# EAGLE design Board1a (EAGLE 7.4.0)
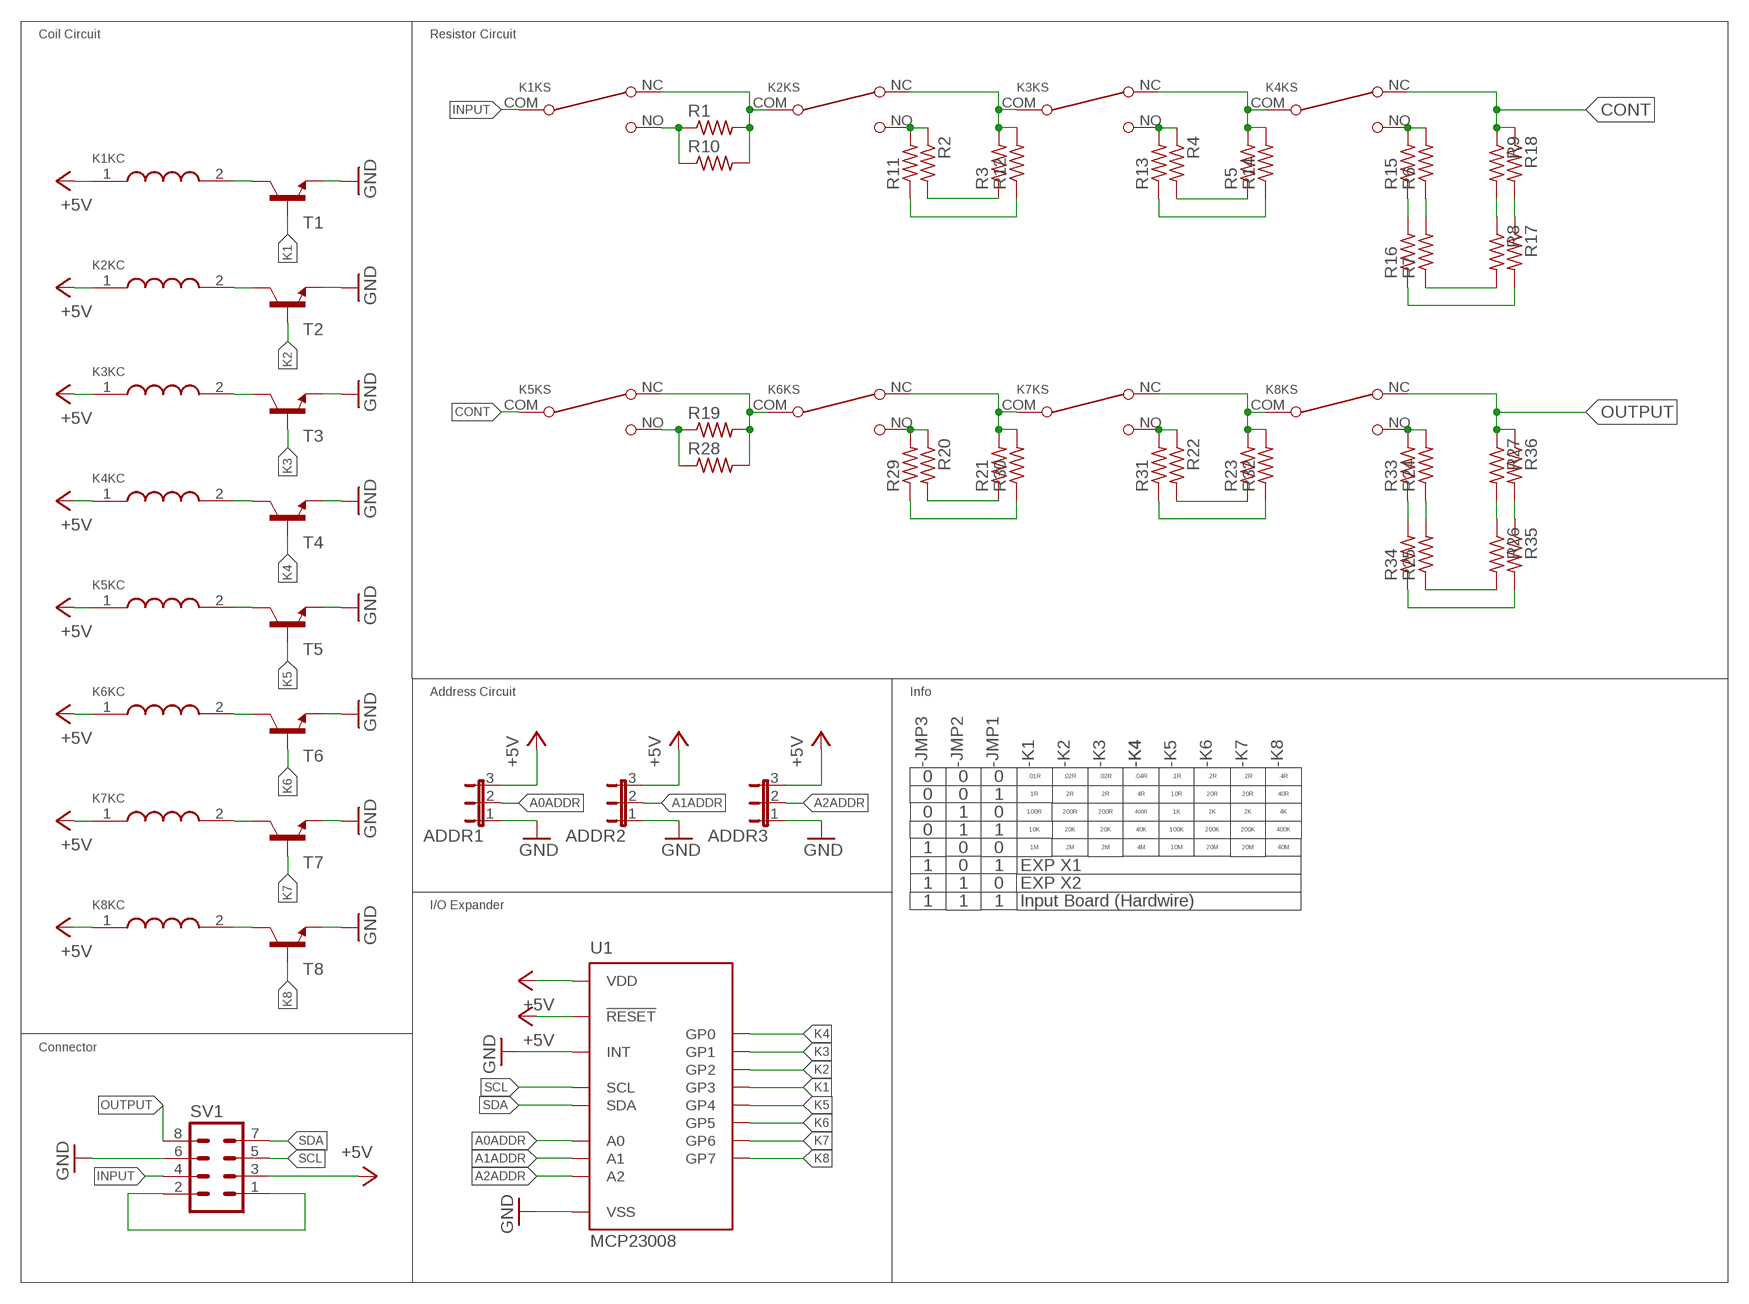
[diagram p0: schematic, sheet 1]

## Parts
ADDR1  JP2E  [JP2]
ADDR2  JP2E  [JP2]
ADDR3  JP2E  [JP2]
K1  G5LE-1-VD DC12  G5LE  [G5LE]
K2  G5LE  [G5LE]
K3  G5LE  [G5LE]
K4  G5LE  [G5LE]
K5  G5LE-1-VD DC12  G5LE  [G5LE]
K6  G5LE  [G5LE]
K7  G5LE  [G5LE]
K8  G5LE  [G5LE]
R1  R-US_0613/5V  [P0613V]
R2  R-US_0613/5V  [P0613V]
R3  R-US_0613/5V  [P0613V]
R4  R-US_0613/5V  [P0613V]
R5  R-US_0613/5V  [P0613V]
R6  R-US_0613/5V  [P0613V]
R7  R-US_0613/5V  [P0613V]
R8  R-US_0613/5V  [P0613V]
R9  R-US_0613/5V  [P0613V]
R10  R-US_M1206  [M1206]
R11  R-US_M1206  [M1206]
R12  R-US_M1206  [M1206]
R13  R-US_M1206  [M1206]
R14  R-US_M1206  [M1206]
R15  R-US_M1206  [M1206]
R16  R-US_M1206  [M1206]
R17  R-US_M1206  [M1206]
R18  R-US_M1206  [M1206]
R19  R-US_0613/5V  [P0613V]
R20  R-US_0613/5V  [P0613V]
R21  R-US_0613/5V  [P0613V]
R22  R-US_0613/5V  [P0613V]
R23  R-US_0613/5V  [P0613V]
R24  R-US_0613/5V  [P0613V]
R25  R-US_0613/5V  [P0613V]
R26  R-US_0613/5V  [P0613V]
R27  R-US_0613/5V  [P0613V]
R28  R-US_M1206  [M1206]
R29  R-US_M1206  [M1206]
R30  R-US_M1206  [M1206]
R31  R-US_M1206  [M1206]
R32  R-US_M1206  [M1206]
R33  R-US_M1206  [M1206]
R34  R-US_M1206  [M1206]
R35  R-US_M1206  [M1206]
R36  R-US_M1206  [M1206]
SV1  MA04-2  [MA04-2]
T1  MMUN2211LT1-NPN-SC59-BEC  [SC59-BEC]
T2  MMUN2211LT1-NPN-SC59-BEC  [SC59-BEC]
T3  MMUN2211LT1-NPN-SC59-BEC  [SC59-BEC]
T4  MMUN2211LT1-NPN-SC59-BEC  [SC59-BEC]
T5  MMUN2211LT1-NPN-SC59-BEC  [SC59-BEC]
T6  MMUN2211LT1-NPN-SC59-BEC  [SC59-BEC]
T7  MMUN2211LT1-NPN-SC59-BEC  [SC59-BEC]
T8  MMUN2211LT1-NPN-SC59-BEC  [SC59-BEC]
U1  MCP23008  [SOIC]

## Nets
+5V: ADDR1.3 ADDR2.3 ADDR3.3 K1.1(KC:COILA) K2.1(KC:COILA) K3.1(KC:COILA) K4.1(KC:COILA) K5.1(KC:COILA) K6.1(KC:COILA) K7.1(KC:COILA) K8.1(KC:COILA) SV1.3 U1.P$6(!RESET) U1.P$18(VDD)
A0ADDR: ADDR1.2 U1.P$5(A0)
A1ADDR: ADDR2.2 U1.P$4(A1)
A2ADDR: ADDR3.2 U1.P$3(A2)
CONT: K4.NC(KS:P$NC) K5.COM(KS:P$COM) R9.1 R18.1
GND: ADDR1.1 ADDR2.1 ADDR3.1 SV1.6 T1.E T2.E T3.E T4.E T5.E T6.E T7.E T8.E U1.P$8(INT) U1.P$9(VSS)
INPUT: K1.COM(KS:P$COM) SV1.4
K1: T1.B U1.P$13(GP3)
K2: T2.B U1.P$12(GP2)
K3: T3.B U1.P$11(GP1)
K4: T4.B U1.P$10(GP0)
K5: T5.B U1.P$14(GP4)
K6: T6.B U1.P$15(GP5)
K7: T7.B U1.P$16(GP6)
K8: T8.B U1.P$17(GP7)
N$1: K1.NO(KS:P$NO) R1.1 R10.1
N$2: K1.NC(KS:P$NC) K2.COM(KS:P$COM) R1.2 R10.2
N$3: R2.2 R3.1
N$4: K2.NC(KS:P$NC) K3.COM(KS:P$COM) R3.2 R12.2
N$5: SV1.1 SV1.2
N$6: K2.NO(KS:P$NO) R2.1 R11.2
N$7: K3.NC(KS:P$NC) K4.COM(KS:P$COM) R5.2 R14.2
N$8: K3.NO(KS:P$NO) R4.1 R13.2
N$9: K4.NO(KS:P$NO) R6.2 R15.2
N$10: R4.2 R5.1
N$11: K3.2(KC:COILB) T3.C
N$12: R6.1 R7.2
N$13: K1.2(KC:COILB) T1.C
N$14: R7.1 R8.2
N$15: K2.2(KC:COILB) T2.C
N$16: R8.1 R9.2
N$17: K4.2(KC:COILB) T4.C
N$18: R15.1 R16.2
N$19: R16.1 R17.2
N$20: R17.1 R18.2
N$21: R11.1 R12.1
N$22: R13.1 R14.1
N$23: K5.NC(KS:P$NC) K6.COM(KS:P$COM) R19.2 R28.2
N$24: K6.NC(KS:P$NC) K7.COM(KS:P$COM) R21.2 R30.2
N$25: K7.NC(KS:P$NC) K8.COM(KS:P$COM) R23.2 R32.2
N$26: K5.NO(KS:P$NO) R19.1 R28.1
N$27: R20.2 R21.1
N$28: K6.NO(KS:P$NO) R20.1 R29.2
N$29: K7.NO(KS:P$NO) R22.1 R31.2
N$30: R22.2 R23.1
N$31: K8.NO(KS:P$NO) R24.2 R33.2
N$32: R24.1 R25.2
N$33: R25.1 R26.2
N$34: R26.1 R27.2
N$35: R33.1 R34.2
N$36: R34.1 R35.2
N$37: R35.1 R36.2
N$38: R29.1 R30.1
N$39: R31.1 R32.1
N$40: K7.2(KC:COILB) T7.C
N$41: K5.2(KC:COILB) T5.C
N$42: K6.2(KC:COILB) T6.C
N$43: K8.2(KC:COILB) T8.C
OUTPUT: K8.NC(KS:P$NC) R27.1 R36.1 SV1.8
SCL: SV1.5 U1.P$1(SCL)
SDA: SV1.7 U1.P$2(SDA)

## Notes on the sheet
- Coil Circuit | Resistor Circuit
- Address Circuit | Info
- -JMP3 | -JMP2 | -JMP1 | -K1 | -K2 | -K3 | -K4 | -K4 | -K5 | -K6 | -K7 | -K8
- 0 | 0 | 0 | .01R | .02R | .02R | .04R | .1R | .2R | .2R | .4R
- 0 | 0 | 1 | 1R | 2R | 2R | 4R | 10R | 20R | 20R | 40R
- 0 | 1 | 0 | 100R | 200R | 200R | 400R | 1K | 2K | 2K | 4K
- 0 | 1 | 1 | 10K | 20K | 20K | 40K | 100K | 200K | 200K | 400K
- 1 | 0 | 0 | 1M | 2M | 2M | 4M | 10M | 20M | 20M | 40M
- 1 | 0 | 1 | EXP X1
- 1 | 1 | 0 | EXP X2
- 1 | 1 | 1 | Input Board (Hardwire)
- I/O Expander
- Connector

## Library data of the parts
ADDR1-ADDR3 = jumper:JP2E: JUMPER
K1-K8 = Jeremy:G5LE; G5LE: -1
R1-R36 = resistor:R-US_: RESISTOR, American symbol
SV1 = con-lstb:MA04-2: PIN HEADER; OC_FARNELL: unknown; OC_NEWARK: unknown
T1-T8 = transistor-neu-to92:*-NPN-: NPN Transistror
U1 = Jeremy:MCP23008: MCP23008 8-Bit I/O Expander I2C Interface ADDR: S0100XXX

## Net classes
0 default: clearance 0.205 mm

## Board
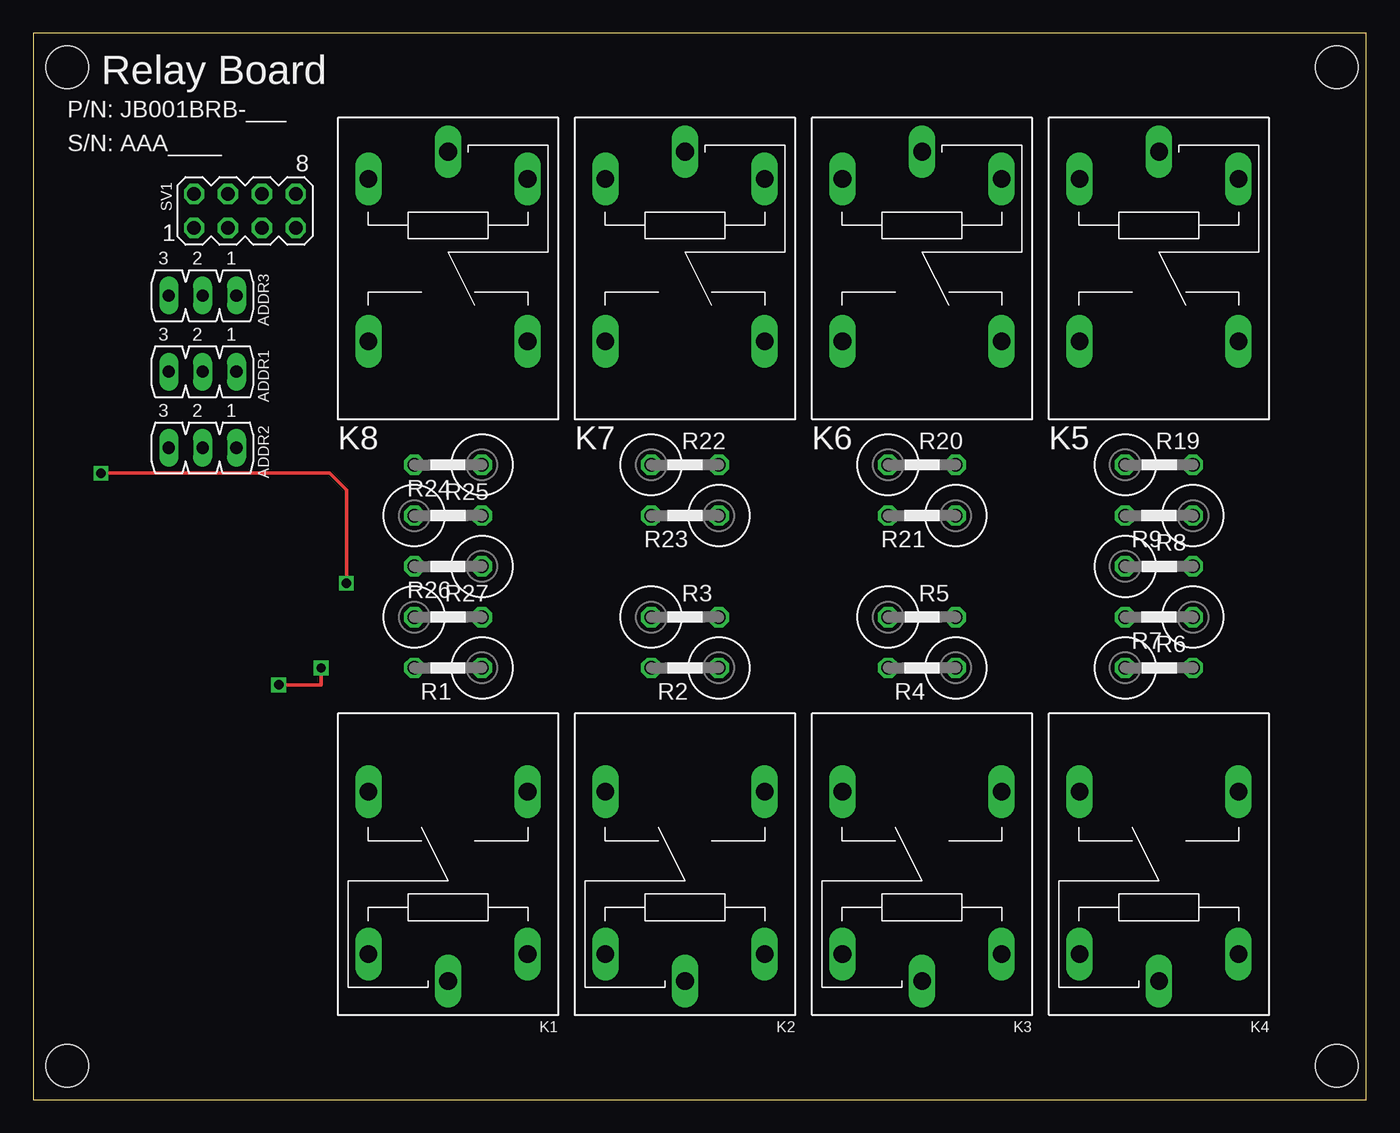
[diagram p1: board, top side]
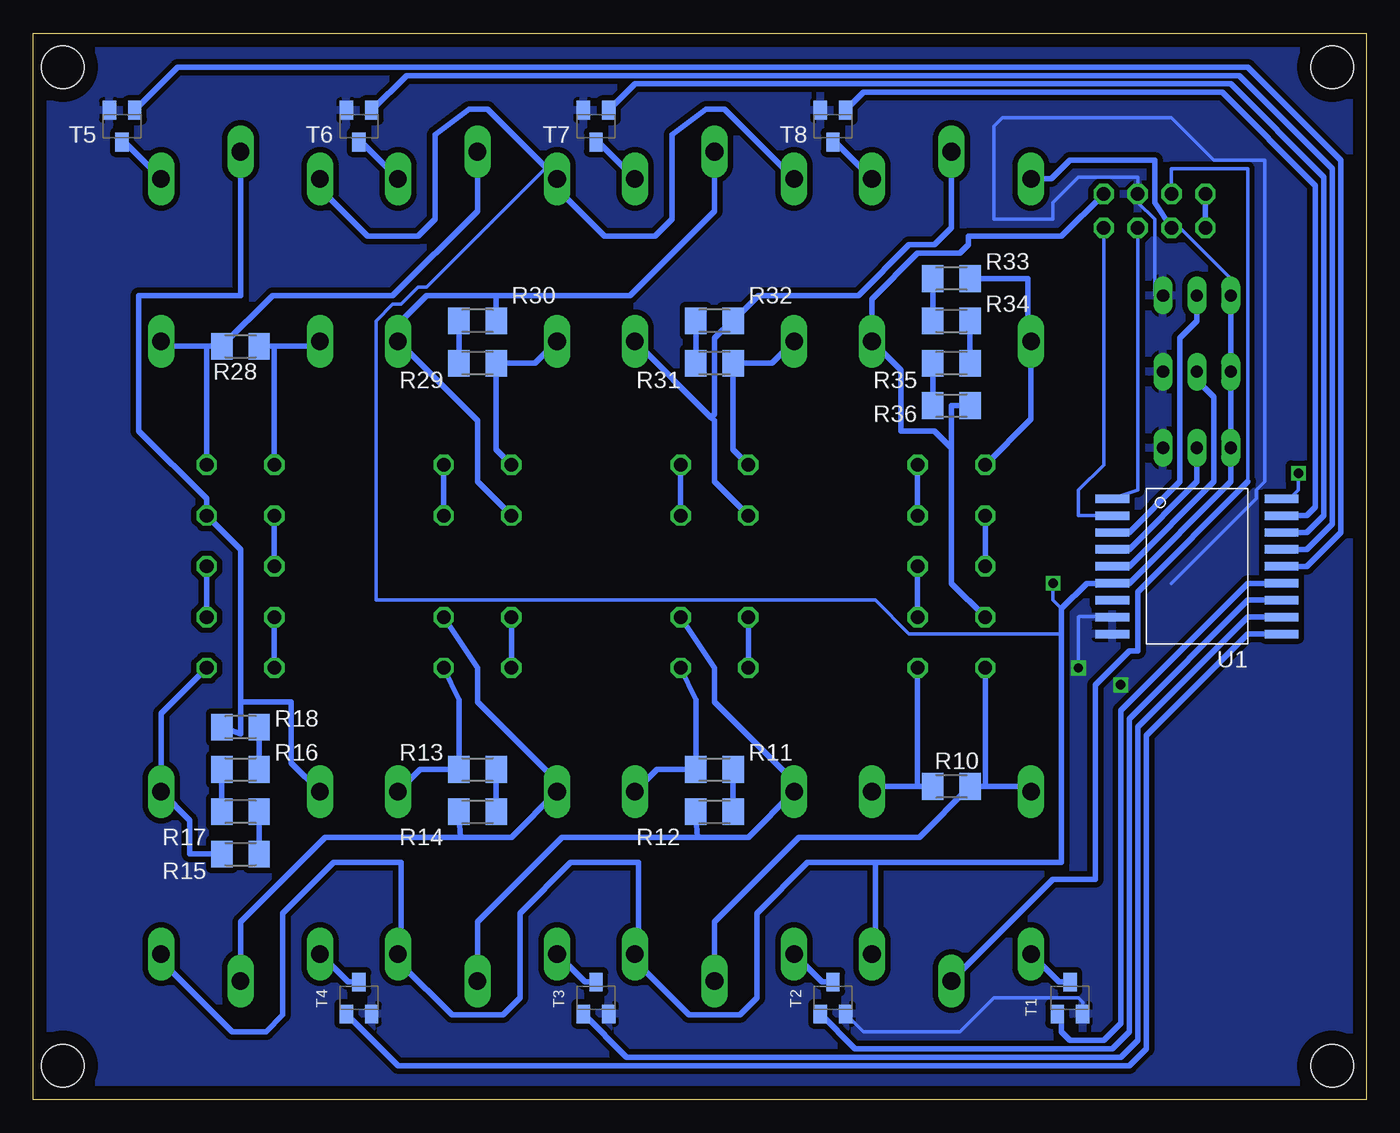
[diagram p2: board, bottom side, seen from below]

Size 100 x 80 mm. Coordinates in mm from the lower left corner, seen from the top.
Outline: 0,0 100,0 100,80 0,80 0,0
Copper layers (1*16): Top 0.035mm / dielectric 1.5mm / Bottom 0.035mm
Design rules "default": minimum track width 10mil, minimum drill 24mil, track to track 8mil, track to pad 8mil, pad to pad 8mil, via to via 8mil, smd to smd 8mil, copper to edge 40mil, drill to drill 8mil, minimum pad ring 10mil, minimum via ring 8mil, stop-mask expansion 4mil, vias tented up to drill 0mil, thermal gap 10mil
Holes 3.2 mm at 2.54,2.54 97.79,2.54 97.79,77.47 2.54,77.47

### Footprints (pad centres in the part's own frame; a part is rotated, then mirrored left to right if it is on the bottom)
JP2 = drill 0.914 long: 1 -2.54,0; 2 0,0; 3 2.54,0
G5LE = drill 1.321 long: 1 -7.493,-5.969; 2 -7.493,5.969; COM -9.525,0; NC 4.699,5.969; NO 4.699,-5.969
P0613V = drill 1.016 octagon: 1 -2.54,0; 2 2.54,0
M1206 = smd 1.6 x 2: 1 -1.4,0; 2 1.4,0
MA04-2 = drill 1.016 octagon: 1 -3.81,-1.27; 2 -3.81,1.27; 3 -1.27,-1.27; 4 -1.27,1.27; 5 1.27,-1.27; 6 1.27,1.27; 7 3.81,-1.27; 8 3.81,1.27
SC59-BEC = smd 1 x 1.4: B -0.95,-1.2; C 0,1.2; E 0.95,-1.2
SOIC = smd 2.54 x 0.635: P$1 6.35,-5.08; P$2 6.35,-3.81; P$3 6.35,-2.54; P$4 6.35,-1.27; P$5 6.35,0; P$6 6.35,1.27; P$7 6.35,2.54; P$8 6.35,3.81; P$9 6.35,5.08; P$10 -6.35,5.08; P$11 -6.35,3.81; P$12 -6.35,2.54; P$13 -6.35,1.27; P$14 -6.35,0; P$15 -6.35,-1.27; P$16 -6.35,-2.54; P$17 -6.35,-3.81; P$18 -6.35,-5.08

### Placement (x,y rotation side)
ADDR1  12.7,54.61 180 top
ADDR2  12.7,48.9 180 top
ADDR3  12.7,60.33 180 top
K1  31.11,18.41 90 top
K2  48.9,18.41 90 top
K3  66.67,18.41 90 top
K4  84.45,18.41 90 top
K5  84.45,61.59 270 top
K6  66.67,61.59 270 top
K7  48.9,61.59 270 top
K8  31.11,61.59 270 top
R1  31.11,32.38 180 top
R2  48.9,32.38 180 top
R3  48.9,36.2 0 top
R4  66.67,32.38 180 top
R5  66.67,36.2 0 top
R6  84.45,32.38 0 top
R7  84.45,36.2 180 top
R8  84.45,40.01 0 top
R9  84.45,43.81 180 top
R10  31.11,23.5 0 bottom
R11  48.9,24.77 180 bottom
R12  48.9,21.59 180 bottom
R13  66.67,24.77 180 bottom
R14  66.67,21.59 180 bottom
R15  84.45,18.41 180 bottom
R16  84.45,21.59 0 bottom
R17  84.45,24.77 180 bottom
R18  84.45,27.94 0 bottom
R19  84.45,47.62 0 top
R20  66.67,47.62 0 top
R21  66.67,43.81 180 top
R22  48.9,47.62 0 top
R23  48.9,43.81 180 top
R24  31.11,47.62 180 top
R25  31.11,43.81 0 top
R26  31.11,40.01 180 top
R27  31.11,36.2 0 top
R28  84.45,56.52 180 bottom
R29  66.67,55.24 0 bottom
R30  66.67,58.42 0 bottom
R31  48.9,55.24 0 bottom
R32  48.9,58.42 0 bottom
R33  31.11,61.59 0 bottom
R34  31.11,58.42 180 bottom
R35  31.11,55.24 0 bottom
R36  31.11,52.07 180 bottom
SV1  15.88,66.67 0 top
T1  22.23,7.62 0 bottom
T2  40.01,7.62 0 bottom
T3  57.78,7.62 0 bottom
T4  75.56,7.62 0 bottom
T5  93.34,73.03 180 bottom
T6  75.56,73.03 180 bottom
T7  57.78,73.03 180 bottom
T8  40.01,73.03 180 bottom
U1  12.7,40.01 180 bottom

### Tracks (layer width: path | path; a pad name or v marks a point on that pad's centre or on a via)
+5V  (via drill 0.7)
  Top 0.254: v5.08,46.99 22.23,46.99 23.5,45.72 v23.5,38.73
  Bottom 0.254: 22.86,34.92 34.29,34.92 36.83,37.47 74.3,37.47 74.3,58.42 73.03,59.69 72.39,59.69 71.12,60.96 70.48,60.96 61.59,69.85 K6.1 | SV1.3 13.97,65.41 10.16,61.59 ADDR3.3 | v23.5,38.73 23.5,37.47 22.86,36.83 | U1.P$18 5.71,45.09 5.08,45.72 v5.08,46.99
  Bottom 0.406: K4.1 90.42,10.41 85.09,5.08 82.55,5.08 81.28,6.35 81.28,13.97 77.47,17.78 72.39,17.78 72.39,11.18 | 72.39,11.18 K3.1 | 72.39,11.18 72.39,10.16 68.58,6.35 64.77,6.35 63.5,7.62 63.5,13.97 59.69,17.78 54.61,17.78 54.61,11.18 | 54.61,11.18 K2.1 | 54.61,11.18 54.61,10.16 50.8,6.35 46.99,6.35 45.72,7.62 45.72,13.97 41.91,17.78 36.83,17.78 | 36.83,17.78 36.83,11.18 K1.1 | K7.1 48.13,74.3 49.53,74.3 52.07,72.39 52.07,66.04 53.34,64.77 57.15,64.77 60.71,68.33 K6.1 65.91,74.3 67.31,74.3 69.85,72.39 69.85,66.04 71.12,64.77 74.93,64.77 78.49,68.33 K5.1 | ADDR3.3 ADDR1.3 ADDR2.3 10.16,46.35 17.78,38.73 U1.P$6 20.95,38.73 22.86,36.83 22.86,34.92 22.86,17.78 36.83,17.78 | K8.1 23.62,69.09 22.23,70.48 15.88,70.48 15.88,67.31 SV1.3
A0ADDR
  Bottom 0.406: ADDR1.2 12.7,53.98 11.43,52.7 11.43,46.35 17.78,40.01 U1.P$5
A1ADDR
  Bottom 0.406: ADDR2.2 12.7,46.35 17.78,41.27 U1.P$4
A2ADDR
  Bottom 0.406: ADDR3.2 12.7,58.42 13.97,57.15 13.97,46.35 17.78,42.55 U1.P$3
CONT
  Bottom 0.406: 84.45,29.84 84.45,41.27 R9.1 87,45.09 92.08,50.16 92.08,60.33 84.45,60.33 K5.COM | 84.45,29.84 84.45,27.43 R18.1 | K4.NC 80.64,25.27 80.64,29.84 84.45,29.84
GND  (via drill 0.7)
  Top 0.254: v21.59,32.38 21.59,31.11 v18.41,31.11
  Bottom 0.254: 19.05,36.26 U1.P$8 | 19.05,36.26 U1.P$8 | U1.P$8 19.05,36.03 | T1.E 21.27,7.3 21.59,7.62 27.94,7.62 30.48,5.08 37.72,5.08 T2.E | ADDR3.1 15.88,60.33 15.88,66.04 17.14,67.31 SV1.6 17.14,69.22 21.59,69.22 23.5,67.31 23.5,66.04 27.94,66.04 27.94,73.03 27.3,73.66 14.61,73.66 11.43,70.48 7.62,70.48 7.62,46.35 8.26,45.72 8.26,45.09 14.61,38.73 | 19.05,36.26 21.52,36.26 21.59,36.2 v21.59,32.38
  pour Bottom (isolate 0.406): 0,80.01 0,0 100.33,0 100.33,80.01
INPUT
  Bottom 0.254: 8.89,46.35 8.89,69.85 14.61,69.85 SV1.4
  Bottom 0.406: K1.COM 23.5,16.51 20.32,16.51 20.32,31.11 17.78,33.66 17.14,33.66 17.14,38.1 8.89,46.35
K1
  Bottom 0.406: U1.P$13 8.89,38.73 18.41,29.21 18.41,5.71 19.68,4.45 22.23,4.45 22.86,5.08 22.86,6.11 T1.B
K2
  Bottom 0.406: T2.B 38.34,3.81 19.05,3.81 17.78,5.08 17.78,28.57 8.89,37.47 U1.P$12
K3
  Bottom 0.406: T3.B 55.49,3.17 18.41,3.17 17.14,4.45 17.14,27.94 8.89,36.2 U1.P$11
K4
  Bottom 0.406: T4.B 72.64,2.54 17.78,2.54 16.51,3.81 16.51,27.3 8.89,34.92 U1.P$10
K5
  Bottom 0.406: U1.P$14 4.45,40.01 1.91,42.55 1.91,70.48 8.89,77.47 89.15,77.47 T5.B
K6
  Bottom 0.406: U1.P$15 4.45,41.27 2.54,43.18 2.54,69.85 9.53,76.83 72,76.83 T6.B
K7
  Bottom 0.406: U1.P$16 4.45,42.55 3.17,43.81 3.17,69.22 10.16,76.2 54.86,76.2 T7.B
K8
  Bottom 0.406: U1.P$17 4.45,43.81 3.81,44.45 3.81,68.58 10.79,75.56 37.72,75.56 T8.B
N$1
  Bottom 0.406: K1.NO 36.7,23.5 33.66,23.5 | 33.66,23.5 R10.1 | R1.1 33.66,23.5
N$2
  Bottom 0.406: K1.NC 25.53,23.5 28.57,23.5 | 28.57,23.5 R10.2 33.52,19.68 42.55,19.68 48.9,13.34 K2.COM | R1.2 28.57,23.5
N$3
  Bottom 0.406: R2.2 R3.1
N$4
  Bottom 0.406: 50.16,19.68 46.35,19.68 K2.NC 42.93,23.88 48.9,29.84 48.9,32.38 R3.2 | 50.16,19.68 50.3,21.09 R12.2 | K3.COM 66.67,13.34 60.33,19.68 50.16,19.68
N$5
  Bottom 0.406: SV1.2 SV1.1
N$6
  Bottom 0.406: K2.NO 53.21,24.77 R11.2 50.3,29.98 R2.1
N$7
  Bottom 0.406: 67.94,19.68 64.14,19.68 K3.NC 60.71,23.88 66.67,29.84 66.67,32.38 R5.2 | 67.94,19.68 68.08,21.09 R14.2 | K4.COM 84.45,13.34 78.11,19.68 67.94,19.68
N$8
  Bottom 0.406: R4.1 68.08,29.98 R13.2 70.99,24.77 K3.NO
N$9
  Bottom 0.406: R15.2 88.27,18.41 88.27,20.95 K4.NO 90.42,28.96 R6.2
N$10
  Bottom 0.406: R5.1 R4.2
N$11
  Bottom 0.406: T3.C 58.6,8.82 K3.2
N$12
  Bottom 0.406: R6.1 R7.2
N$13
  Bottom 0.406: T1.C 23.04,8.82 K1.2
N$14
  Bottom 0.406: R7.1 R8.2
N$15
  Bottom 0.406: T2.C 40.82,8.82 K2.2
N$16
  Bottom 0.406: R8.1 R9.2
N$17
  Bottom 0.406: T4.C 76.38,8.82 K4.2
N$18
  Bottom 0.406: R15.1 R16.2
N$19
  Bottom 0.406: R16.1 R17.2
N$20
  Bottom 0.406: R17.1 R18.2
N$21
  Bottom 0.406: R11.1 R12.1
N$22
  Bottom 0.406: R13.1 R14.1
N$23
  Bottom 0.406: K5.NC 90.04,56.52 87,56.52 | 87,56.52 R28.2 82.05,60.33 73.03,60.33 66.67,66.67 K6.COM | R19.2 87,56.52
N$24
  Bottom 0.406: R21.2 66.67,46.35 66.67,50.93 K6.NC 72.64,58.17 70.48,60.33 65.28,60.33 | R30.2 65.28,60.33 | K7.COM 48.9,66.67 55.24,60.33 65.28,60.33
N$25
  Bottom 0.406: R23.2 48.9,46.35 48.9,50.93 49.15,51.18 | K7.NC 49.15,51.18 | K8.COM 31.11,65.41 32.38,64.14 34.29,64.14 38.1,60.33 45.59,60.33 R32.2 48.26,57.78 48.9,57.15 48.9,51.44 49.15,51.18
N$26
  Bottom 0.406: K5.NO 78.87,56.52 81.92,56.52 | 81.92,56.52 R28.1 | R19.1 81.92,56.52
N$27
  Bottom 0.406: R20.2 R21.1
N$28
  Bottom 0.406: R29.2 65.41,55.24 | K6.NO 62.36,55.24 R29.2 | R20.1 65.28,48.77 R29.2
N$29
  Bottom 0.406: K7.NO 44.58,55.24 R31.2 47.49,48.77 R22.1
N$30
  Bottom 0.406: R22.2 R23.1
N$31
  Bottom 0.406: R33.2 25.4,61.59 25.4,57.15 25.15,57.03 K8.NO 25.15,51.05 R24.2
N$32
  Bottom 0.406: R24.1 R25.2
N$33
  Bottom 0.406: R25.1 R26.2
N$34
  Bottom 0.406: R26.1 R27.2
N$35
  Bottom 0.406: R33.1 R34.2
N$36
  Bottom 0.406: R34.1 R35.2
N$37
  Bottom 0.406: R35.1 R36.2
N$38
  Bottom 0.406: R29.1 R30.1
N$39
  Bottom 0.406: R31.1 R32.1
N$40
  Bottom 0.406: T7.C 57.6,71.83 K7.2
N$41
  Bottom 0.406: T5.C 93.16,71.83 K5.2
N$42
  Bottom 0.406: T6.C 75.38,71.83 K6.2
N$43
  Bottom 0.406: T8.C 39.82,71.83 K8.2
OUTPUT
  Bottom 0.406: R27.1 31.11,38.73 31.11,48.9 | R36.1 31.11,52.07 31.11,48.9 | 31.11,48.9 32.38,50.16 34.92,50.16 34.92,54.74 K8.NC 37.08,60.07 33.66,63.5 30.48,63.5 29.84,64.14 29.84,64.77 22.86,64.77 SV1.8
SCL
  Bottom 0.254: SV1.5 17.14,45.72 U1.P$1
SDA
  Bottom 0.254: SV1.7 19.68,47.62 21.59,45.72 21.59,43.81 U1.P$2

### Text on the board
_tsilk: Relay Board | P/N: JB001BRB-___ | S/N: AAA____